# Altium schematic sheet stm32f405rgt6_DB_Sheet.SchDoc
size A3
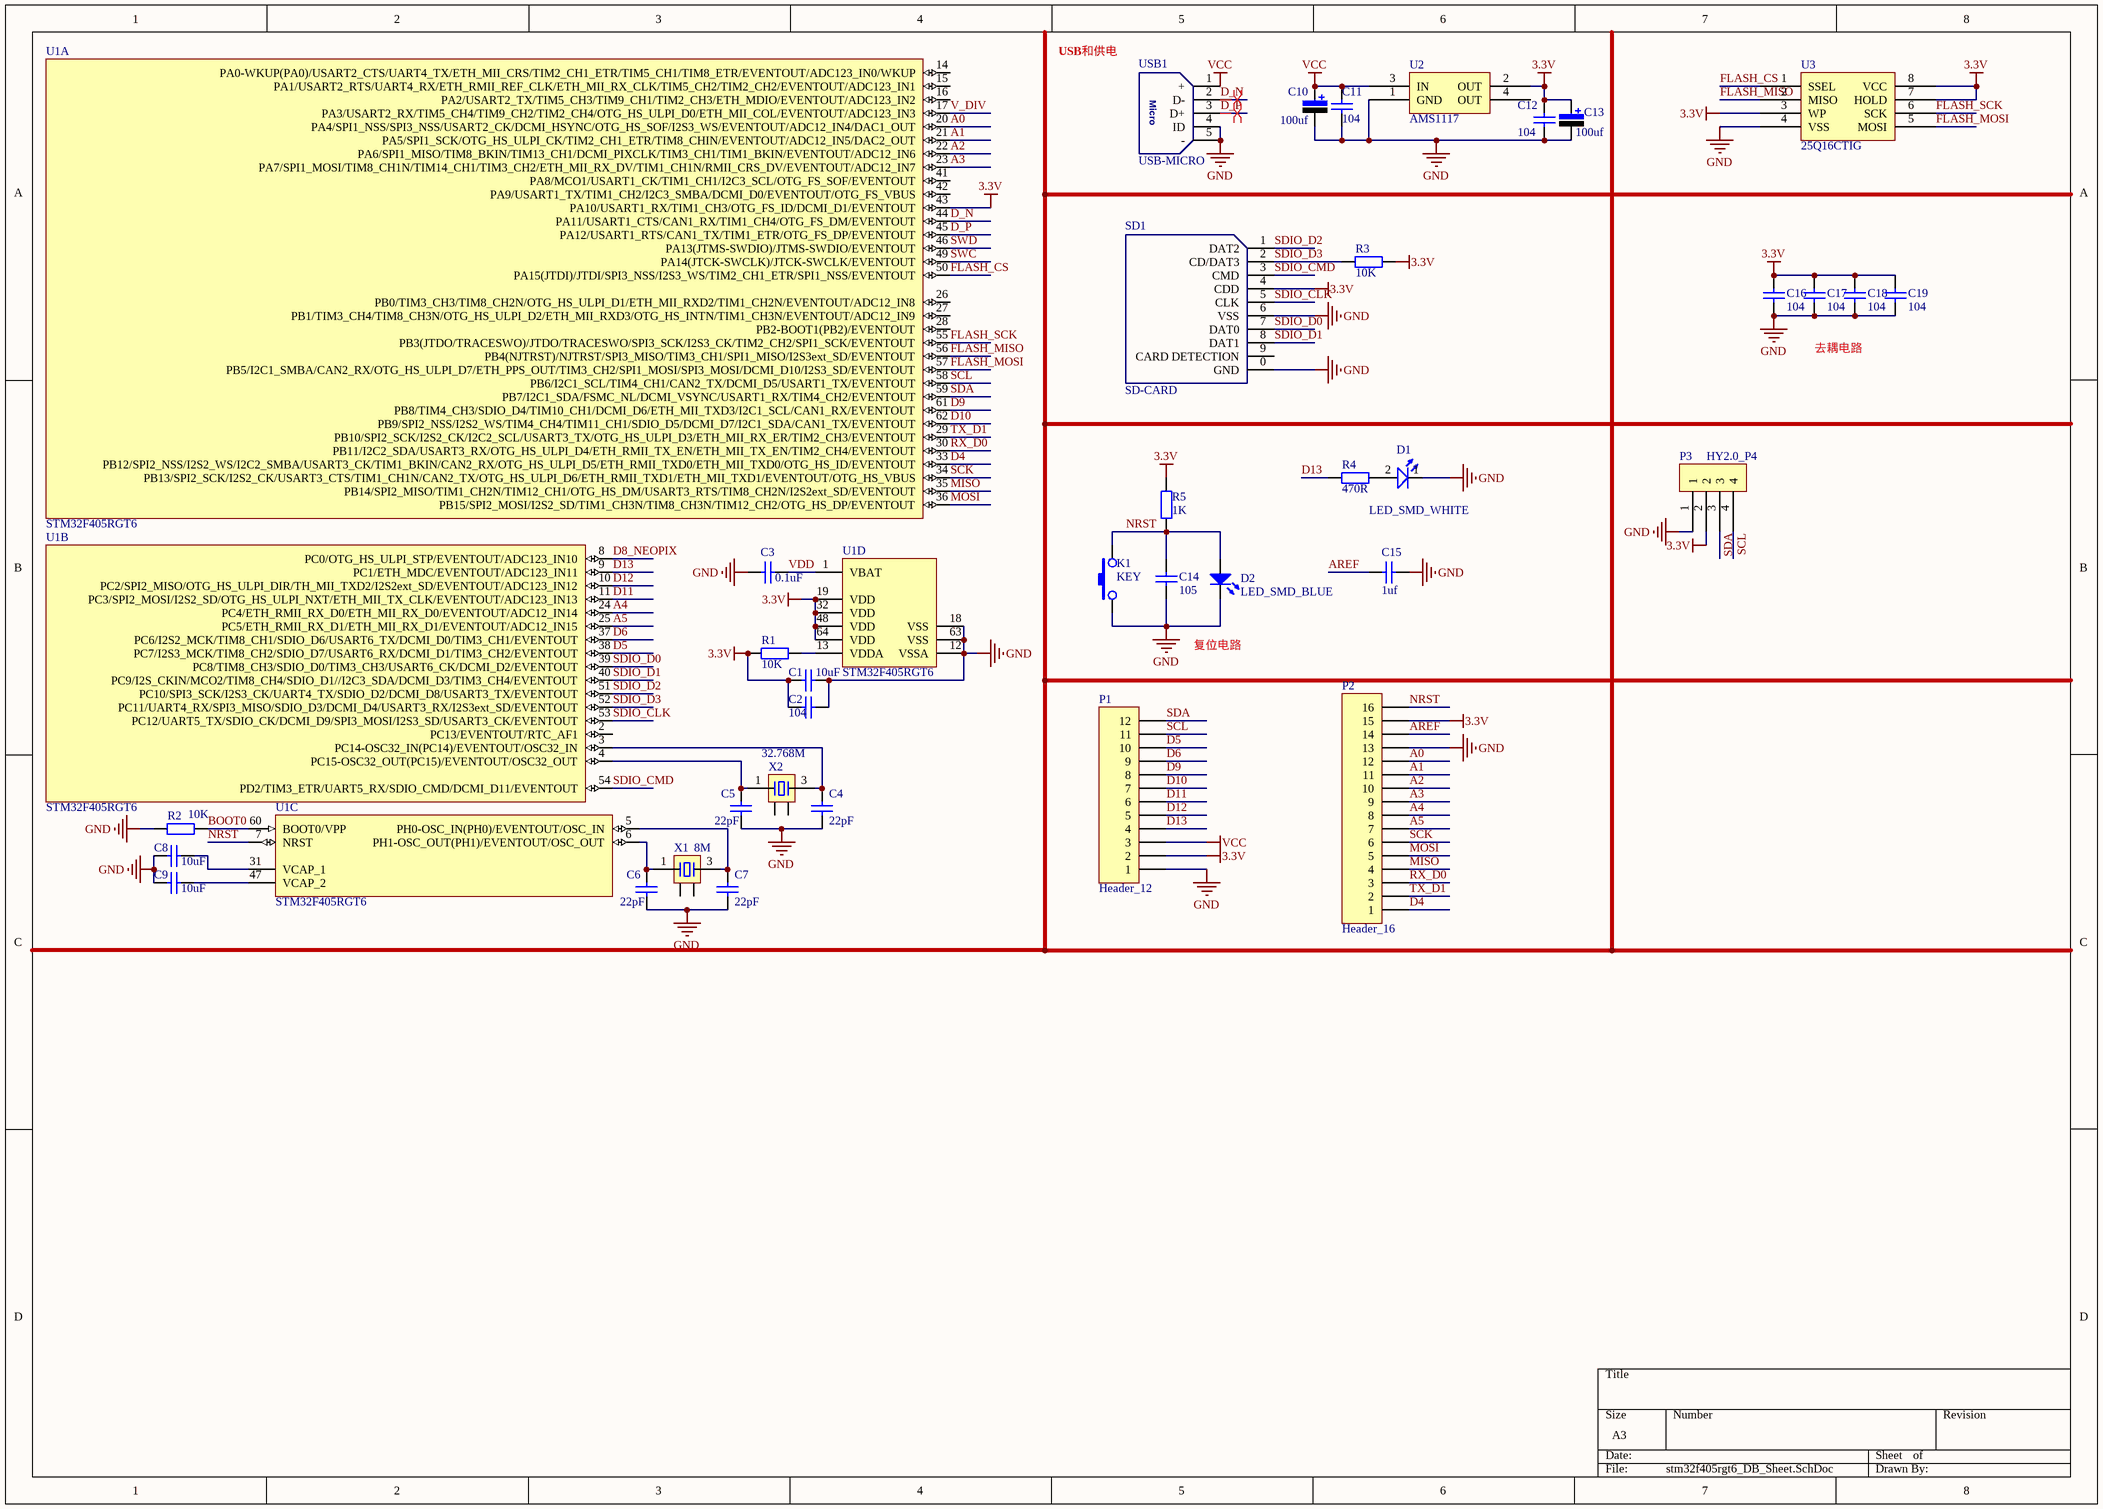
[diagram p0: stm32f405rgt6_DB_Sheet.SchDoc]

## Parts
C1  10uF  [Cap-0603]
C2  104  [Cap-0603]
C3  0.1uF  [Cap-0603]
C4  22pF  [Cap-0603]
C5  22pF  [Cap-0603]
C6  22pF  [Cap-0603]
C7  22pF  [Cap-0603]
C8  10uF  [Cap-0603]
C9  10uF  [Cap-0603]
C10  100uf  [CAP_TAN_3216_A]
C11  104  [Cap-0603]
C12  104  [Cap-0603]
C13  100uf  [CAP_TAN_3216_A]
C14  105  [Cap-0603]
C15  1uf  [Cap-0603]
C16  104  [Cap-0603]
C17  104  [Cap-0603]
C18  104  [Cap-0603]
C19  104  [Cap-0603]
D1  LED_SMD_WHITE  [LED_0603_W]
D2  LED_SMD_BLUE  [LED_0603_B]
K1  KEY  [SW-SMD-2X4]
P1  Header_12  [Header 2.54X12]
P2  Header_16  [Header 2.54X16]
P3  HY2.0_P4  [HY2.0_P4]
R1  10K  [Res-0603]
R2  10K  [Res-0603]
R3  10K  [Res-0603]
R4  470R  [Res-0603]
R5  1K  [Res-0603]
SD1  SD-CARD  [SD-CARD-Micro]
U1  STM32F405RGT6  [TQFP64_V]  (parts A,B,C,D of 4)
U2  AMS1117  [SOT89]
U3  25Q16CTIG  [SOP8_M]
USB1  USB-MICRO  [USB-MICRO-SMD_C]
X1  8M  [OSC 3225-4P]
X2  32.768M  [OSC 3225-4P]

## Nets
3.3V: C1.1 C2.1 C12.2 C13.1 C16.2 C17.2 C18.2 C19.2 P1.2 P2.15 P3.2 R1.1 R3.2 R5.1 SD1.4(CDD) U1.19(VDD) U1.32(VDD) U1.43(PA10/USART1_RX/TIM1_CH3/OTG_FS_ID/DCMI_D1/EVENTOUT) U1.48(VDD) U1.64(VDD) U2.2(OUT) U3.3(WP) U3.7(HOLD) U3.8(VCC)
GND: C1.2 C2.2 C3.1 C4.1 C5.2 C6.2 C7.1 C8.1 C9.1 C10.2 C11.1 C12.1 C13.2 C14.1 C15.1 C16.1 C17.1 C18.1 C19.1 D1.1(K) D2.1(K) K1.1 P1.1 P2.13 P3.1 R2.1 SD1.0(GND) SD1.6(VSS) U1.12(VSSA) U1.18(VSS) U1.63(VSS) U2.1(GND) U3.4(VSS) USB1.4(ID) USB1.5(-)
VCC: C10.1 C11.2 P1.3 U2.3(IN) USB1.1(+)
A0: P2.12 U1.20(PA4/SPI1_NSS/SPI3_NSS/USART2_CK/DCMI_HSYNC/OTG_HS_SOF/I2S3_WS/EVENTOUT/ADC12_IN4/DAC1_OUT)
A1: P2.11 U1.21(PA5/SPI1_SCK/OTG_HS_ULPI_CK/TIM2_CH1_ETR/TIM8_CHIN/EVENTOUT/ADC12_IN5/DAC2_OUT)
A2: P2.10 U1.22(PA6/SPI1_MISO/TIM8_BKIN/TIM13_CH1/DCMI_PIXCLK/TIM3_CH1/TIM1_BKIN/EVENTOUT/ADC12_IN6)
A3: P2.9 U1.23(PA7/SPI1_MOSI/TIM8_CH1N/TIM14_CH1/TIM3_CH2/ETH_MII_RX_DV/TIM1_CH1N/RMII_CRS_DV/EVENTOUT/ADC12_IN7)
A4: P2.8 U1.24(PC4/ETH_RMII_RX_D0/ETH_MII_RX_D0/EVENTOUT/ADC12_IN14)
A5: P2.7 U1.25(PC5/ETH_RMII_RX_D1/ETH_MII_RX_D1/EVENTOUT/ADC12_IN15)
AREF: C15.2 P2.14
BOOT0: R2.2 U1.60(BOOT0/VPP)
D4: P2.1 U1.33(PB12/SPI2_NSS/I2S2_WS/I2C2_SMBA/USART3_CK/TIM1_BKIN/CAN2_RX/OTG_HS_ULPI_D5/ETH_RMII_TXD0/ETH_MII_TXD0/OTG_HS_ID/EVENTOUT)
D5: P1.10 U1.38(PC7/I2S3_MCK/TIM8_CH2/SDIO_D7/USART6_RX/DCMI_D1/TIM3_CH2/EVENTOUT)
D6: P1.9 U1.37(PC6/I2S2_MCK/TIM8_CH1/SDIO_D6/USART6_TX/DCMI_D0/TIM3_CH1/EVENTOUT)
D8_NEOPIX: U1.8(PC0/OTG_HS_ULPI_STP/EVENTOUT/ADC123_IN10)
D9: P1.8 U1.61(PB8/TIM4_CH3/SDIO_D4/TIM10_CH1/DCMI_D6/ETH_MII_TXD3/I2C1_SCL/CAN1_RX/EVENTOUT)
D10: P1.7 U1.62(PB9/SPI2_NSS/I2S2_WS/TIM4_CH4/TIM11_CH1/SDIO_D5/DCMI_D7/I2C1_SDA/CAN1_TX/EVENTOUT)
D11: P1.6 U1.11(PC3/SPI2_MOSI/I2S2_SD/OTG_HS_ULPI_NXT/ETH_MII_TX_CLK/EVENTOUT/ADC123_IN13)
D12: P1.5 U1.10(PC2/SPI2_MISO/OTG_HS_ULPI_DIR/TH_MII_TXD2/I2S2ext_SD/EVENTOUT/ADC123_IN12)
D13: P1.4 R4.1 U1.9(PC1/ETH_MDC/EVENTOUT/ADC123_IN11)
D_N: U1.44(PA11/USART1_CTS/CAN1_RX/TIM1_CH4/OTG_FS_DM/EVENTOUT) USB1.2(D-)
D_P: U1.45(PA12/USART1_RTS/CAN1_TX/TIM1_ETR/OTG_FS_DP/EVENTOUT) USB1.3(D+)
FLASH_CS: U1.50(PA15(JTDI)/JTDI/SPI3_NSS/I2S3_WS/TIM2_CH1_ETR/SPI1_NSS/EVENTOUT) U3.1(SSEL)
FLASH_MISO: U1.56(PB4(NJTRST)/NJTRST/SPI3_MISO/TIM3_CH1/SPI1_MISO/I2S3ext_SD/EVENTOUT) U3.2(MISO)
FLASH_MOSI: U1.57(PB5/I2C1_SMBA/CAN2_RX/OTG_HS_ULPI_D7/ETH_PPS_OUT/TIM3_CH2/SPI1_MOSI/SPI3_MOSI/DCMI_D10/I2S3_SD/EVENTOUT) U3.5(MOSI)
FLASH_SCK: U1.55(PB3(JTDO/TRACESWO)/JTDO/TRACESWO/SPI3_SCK/I2S3_CK/TIM2_CH2/SPI1_SCK/EVENTOUT) U3.6(SCK)
MISO: P2.4 U1.35(PB14/SPI2_MISO/TIM1_CH2N/TIM12_CH1/OTG_HS_DM/USART3_RTS/TIM8_CH2N/I2S2ext_SD/EVENTOUT)
MOSI: P2.5 U1.36(PB15/SPI2_MOSI/I2S2_SD/TIM1_CH3N/TIM8_CH3N/TIM12_CH2/OTG_HS_DP/EVENTOUT)
NRST: C14.2 D2.2(A) K1.3 P2.16 R5.2 U1.7(NRST)
RX_D0: P2.3 U1.30(PB11/I2C2_SDA/USART3_RX/OTG_HS_ULPI_D4/ETH_RMII_TX_EN/ETH_MII_TX_EN/TIM2_CH4/EVENTOUT)
SCK: P2.6 U1.34(PB13/SPI2_SCK/I2S2_CK/USART3_CTS/TIM1_CH1N/CAN2_TX/OTG_HS_ULPI_D6/ETH_RMII_TXD1/ETH_MII_TXD1/EVENTOUT/OTG_HS_VBUS)
SCL: P1.11 P3.4 U1.58(PB6/I2C1_SCL/TIM4_CH1/CAN2_TX/DCMI_D5/USART1_TX/EVENTOUT)
SDA: P1.12 P3.3 U1.59(PB7/I2C1_SDA/FSMC_NL/DCMI_VSYNC/USART1_RX/TIM4_CH2/EVENTOUT)
SDIO_CLK: SD1.5(CLK) U1.53(PC12/UART5_TX/SDIO_CK/DCMI_D9/SPI3_MOSI/I2S3_SD/USART3_CK/EVENTOUT)
SDIO_CMD: SD1.3(CMD) U1.54(PD2/TIM3_ETR/UART5_RX/SDIO_CMD/DCMI_D11/EVENTOUT)
SDIO_D0: SD1.7(DAT0) U1.39(PC8/TIM8_CH3/SDIO_D0/TIM3_CH3/USART6_CK/DCMI_D2/EVENTOUT)
SDIO_D1: SD1.8(DAT1) U1.40(PC9/I2S_CKIN/MCO2/TIM8_CH4/SDIO_D1//I2C3_SDA/DCMI_D3/TIM3_CH4/EVENTOUT)
SDIO_D2: SD1.1(DAT2) U1.51(PC10/SPI3_SCK/I2S3_CK/UART4_TX/SDIO_D2/DCMI_D8/USART3_TX/EVENTOUT)
SDIO_D3: R3.1 SD1.2(CD/DAT3) U1.52(PC11/UART4_RX/SPI3_MISO/SDIO_D3/DCMI_D4/USART3_RX/I2S3ext_SD/EVENTOUT)
SWC: U1.49(PA14(JTCK-SWCLK)/JTCK-SWCLK/EVENTOUT)
SWD: U1.46(PA13(JTMS-SWDIO)/JTMS-SWDIO/EVENTOUT)
TX_D1: P2.2 U1.29(PB10/SPI2_SCK/I2S2_CK/I2C2_SCL/USART3_TX/OTG_HS_ULPI_D3/ETH_MII_RX_ER/TIM2_CH3/EVENTOUT)
V_DIV: U1.17(PA3/USART2_RX/TIM5_CH4/TIM9_CH2/TIM2_CH4/OTG_HS_ULPI_D0/ETH_MII_COL/EVENTOUT/ADC123_IN3)
VDD: C3.2 U1.1(VBAT)
NetC4_2: C4.2 U1.3(PC14-OSC32_IN(PC14)/EVENTOUT/OSC32_IN) X2.3
NetC5_1: C5.1 U1.4(PC15-OSC32_OUT(PC15)/EVENTOUT/OSC32_OUT) X2.1
NetC6_1: C6.1 U1.6(PH1-OSC_OUT(PH1)/EVENTOUT/OSC_OUT) X1.1
NetC7_2: C7.2 U1.5(PH0-OSC_IN(PH0)/EVENTOUT/OSC_IN) X1.3
NetC8_2: C8.2 U1.31(VCAP_1)
NetC9_2: C9.2 U1.47(VCAP_2)
NetD1_2: D1.2(A) R4.2
NetR1_2: R1.2 U1.13(VDDA)

Not connected (* = marked no-connect by the designer): SD1 9(CARD_DETECTION); U1 2(PC13/EVENTOUT/RTC_AF1) 14(PA0-WKUP(PA0)/USART2_CTS/UART4_TX/ETH_MII_CRS/TIM2_CH1_ETR/TIM5_CH1/TIM8_ETR/EVENTOUT/ADC123_IN0/WKUP) 15(PA1/USART2_RTS/UART4_RX/ETH_RMII_REF_CLK/ETH_MII_RX_CLK/TIM5_CH2/TIM2_CH2/EVENTOUT/ADC123_IN1) 16(PA2/USART2_TX/TIM5_CH3/TIM9_CH1/TIM2_CH3/ETH_MDIO/EVENTOUT/ADC123_IN2) 26(PB0/TIM3_CH3/TIM8_CH2N/OTG_HS_ULPI_D1/ETH_MII_RXD2/TIM1_CH2N/EVENTOUT/ADC12_IN8) 27(PB1/TIM3_CH4/TIM8_CH3N/OTG_HS_ULPI_D2/ETH_MII_RXD3/OTG_HS_INTN/TIM1_CH3N/EVENTOUT/ADC12_IN9) 28(PB2-BOOT1(PB2)/EVENTOUT) 41(PA8/MCO1/USART1_CK/TIM1_CH1/I2C3_SCL/OTG_FS_SOF/EVENTOUT) 42(PA9/USART1_TX/TIM1_CH2/I2C3_SMBA/DCMI_D0/EVENTOUT/OTG_FS_VBUS); U2 4(OUT); X1 2 4; X2 2 4

## Layout directives
differential pair: D_N, D_P

## Notes on the sheet
- USB和供电
- 去耦电路
- 复位电路
- (in symbol USB-MICRO) Micro

## Library data of the parts
C1-C9 = CAP: 贴片陶瓷电容
C10 C13 = tan_cap
C11 C12 C14-C19 = CAP
D1 = LED_SMD_WHITE: 发光二极管; ComponentLink1Description: 供应商链接; ComponentLink1URL: http://www.szlcsc.com/product/details_2663.html; Package: 0603; Supplier: LC; SuppliersPartNumber: C2290
D2 = LED_SMD_BLUE: 发光二极管; ComponentLink1Description: 供应商链接; ComponentLink1URL: http://www.szlcsc.com/product/details_73150.html; Package: 0603; Supplier: LC; SuppliersPartNumber: C72041
R1-R5 = RES: 贴片电阻
U1 = STM32F405RGT6: ARM Cortex-M4 32b MCU+FPU, 210DMIP, 1024 kB Flash, 192+4 kB RAM, 51 I/Os, 64-pin LQFP, -40 to +85癈, Tray; Internal RAM: 192kB; Operating Frequency (Processor Speed): 168MHz; A/D Converter: 16x12-bit; D/A Converter: 2x12-bit; 16-bit Timers (IC/OC/PWM): 12x16-bit(24/24/30); 32-bit Timer (IC/OC/PWM): 2x32-bit (8/8/8); Other Timer Functions: 2xWDG, RTC, 24-bit down counter; Serial Interface: 3xSPI/2xI2S/2xI2C/3xUSART(IrDa, ISO7816)/3xUART/1xUSB OTG FS/HS, 2xCAN/ SDIO; DatasheetVersion: rev2, Jan-2012; PackageVersion: 2012; PackageReference: TQFP64; PackageDescription: 64-Pin Low Profile Quad Flat Package, 10x10 mm Body, 0.5 mm Pitch; ComponentLink1Description: Manufacturer URL; ComponentLink1URL: http://www.st.com/; ComponentLink2Description: STM32F405/7 Datasheet; ComponentLink2URL: http://www.st.com/internet/com/TECHNICAL_RESOURCES/TECHNICAL_LITERATURE/DATASHEET/DM00037051.pdf; ComponentLink3Description: STM32F4 Web Page; ComponentLink3URL: http://www.st.com/internet/mcu/subclass/1521.jsp
X1 X2 = XTAL-4P: 4脚无源晶振